# EAGLE schematic ROM (EAGLE 7.3.0)
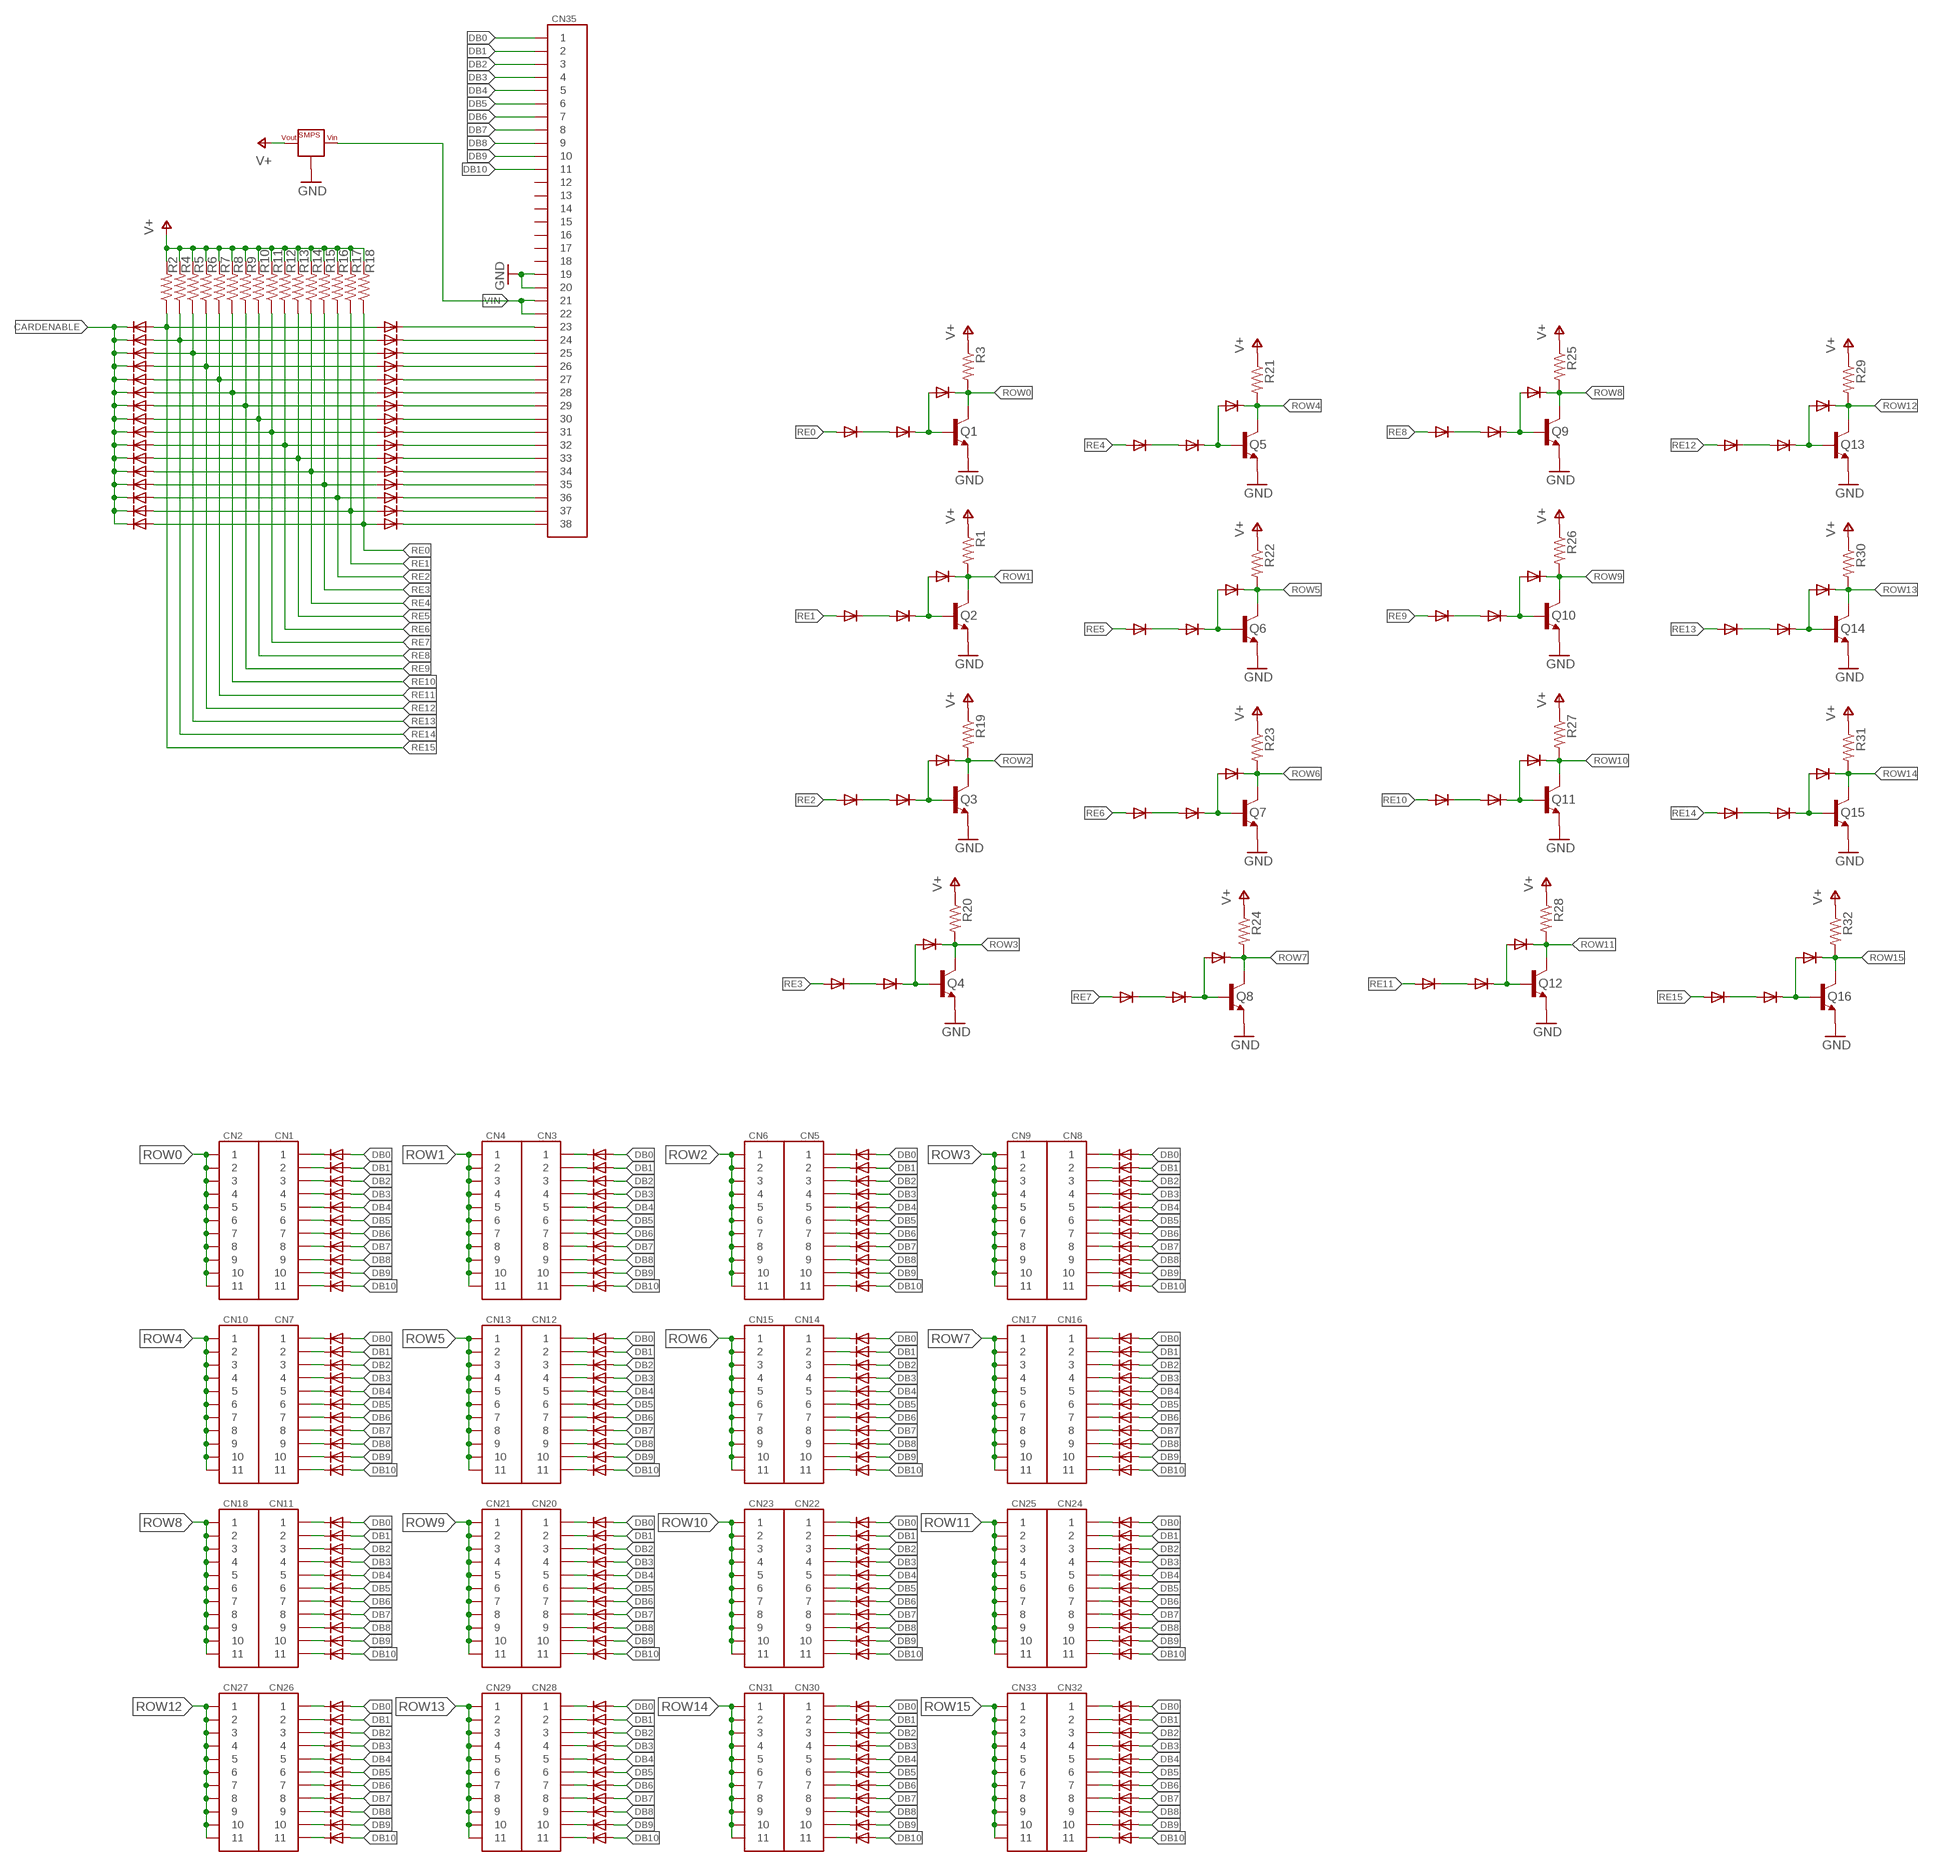
[diagram p0: schematic, sheet 1]

## Parts
CN1  HD11  [HD11]
CN2  HD11  [HD11]
CN3  HD11  [HD11]
CN4  HD11  [HD11]
CN5  HD11  [HD11]
CN6  HD11  [HD11]
CN7  HD11  [HD11]
CN8  HD11  [HD11]
CN9  HD11  [HD11]
CN10  HD11  [HD11]
CN11  HD11  [HD11]
CN12  HD11  [HD11]
CN13  HD11  [HD11]
CN14  HD11  [HD11]
CN15  HD11  [HD11]
CN16  HD11  [HD11]
CN17  HD11  [HD11]
CN18  HD11  [HD11]
CN20  HD11  [HD11]
CN21  HD11  [HD11]
CN22  HD11  [HD11]
CN23  HD11  [HD11]
CN24  HD11  [HD11]
CN25  HD11  [HD11]
CN26  HD11  [HD11]
CN27  HD11  [HD11]
CN28  HD11  [HD11]
CN29  HD11  [HD11]
CN30  HD11  [HD11]
CN31  HD11  [HD11]
CN32  HD11  [HD11]
CN33  HD11  [HD11]
CN35  HD38-HP  [HD38-HOLEPAD]
D1  DIODE-6.3  [DO35-6.3]
D2  DIODE-6.3  [DO35-6.3]
D3  DIODE-6.3  [DO35-6.3]
D4  DIODE-6.3  [DO35-6.3]
D5  DIODE-6.3  [DO35-6.3]
D6  DIODE-6.3  [DO35-6.3]
D7  DIODE-6.3  [DO35-6.3]
D8  DIODE-6.3  [DO35-6.3]
D9  DIODE-6.3  [DO35-6.3]
D10  DIODE-6.3  [DO35-6.3]
D11  DIODE-6.3  [DO35-6.3]
D12  DIODE-6.3  [DO35-6.3]
D13  DIODE-6.3  [DO35-6.3]
D14  DIODE-6.3  [DO35-6.3]
D15  DIODE-6.3  [DO35-6.3]
D16  DIODE-6.3  [DO35-6.3]
D17  DIODE-6.3  [DO35-6.3]
D18  DIODE-6.3  [DO35-6.3]
D19  DIODE-6.3  [DO35-6.3]
D20  DIODE-6.3  [DO35-6.3]
D21  DIODE-6.3  [DO35-6.3]
D22  DIODE-6.3  [DO35-6.3]
D23  DIODE-6.3  [DO35-6.3]
D24  DIODE-6.3  [DO35-6.3]
D25  DIODE-6.3  [DO35-6.3]
D26  DIODE-6.3  [DO35-6.3]
D27  DIODE-6.3  [DO35-6.3]
D28  DIODE-6.3  [DO35-6.3]
D29  DIODE-6.3  [DO35-6.3]
D30  DIODE-6.3  [DO35-6.3]
D31  DIODE-6.3  [DO35-6.3]
D32  DIODE-6.3  [DO35-6.3]
D33  DIODE-6.3  [DO35-6.3]
D34  DIODE-6.3  [DO35-6.3]
D35  DIODE-6.3  [DO35-6.3]
D36  DIODE-6.3  [DO35-6.3]
D37  DIODE-6.3  [DO35-6.3]
D38  DIODE-6.3  [DO35-6.3]
D39  DIODE-6.3  [DO35-6.3]
D40  DIODE-6.3  [DO35-6.3]
D41  DIODE-6.3  [DO35-6.3]
D42  DIODE-6.3  [DO35-6.3]
D43  DIODE-6.3  [DO35-6.3]
D44  DIODE-6.3  [DO35-6.3]
D45  DIODE-6.3  [DO35-6.3]
D46  DIODE-6.3  [DO35-6.3]
D47  DIODE-6.3  [DO35-6.3]
D48  DIODE-6.3  [DO35-6.3]
D49  DIODE-6.3  [DO35-6.3]
D50  DIODE-6.3  [DO35-6.3]
D51  DIODE-6.3  [DO35-6.3]
D52  DIODE-6.3  [DO35-6.3]
D53  DIODE-6.3  [DO35-6.3]
D54  DIODE-6.3  [DO35-6.3]
D55  DIODE-6.3  [DO35-6.3]
D56  DIODE-6.3  [DO35-6.3]
D57  DIODE-6.3  [DO35-6.3]
D58  DIODE-6.3  [DO35-6.3]
D59  DIODE-6.3  [DO35-6.3]
D60  DIODE-6.3  [DO35-6.3]
D61  DIODE-6.3  [DO35-6.3]
D62  DIODE-6.3  [DO35-6.3]
D63  DIODE-6.3  [DO35-6.3]
D64  DIODE-6.3  [DO35-6.3]
D65  DIODE-6.3  [DO35-6.3]
D66  DIODE-6.3  [DO35-6.3]
D67  DIODE-6.3  [DO35-6.3]
D68  DIODE-6.3  [DO35-6.3]
D69  DIODE-6.3  [DO35-6.3]
D70  DIODE-6.3  [DO35-6.3]
D71  DIODE-6.3  [DO35-6.3]
D72  DIODE-6.3  [DO35-6.3]
D73  DIODE-6.3  [DO35-6.3]
D74  DIODE-6.3  [DO35-6.3]
D75  DIODE-6.3  [DO35-6.3]
D76  DIODE-6.3  [DO35-6.3]
D77  DIODE-6.3  [DO35-6.3]
D78  DIODE-6.3  [DO35-6.3]
D79  DIODE-6.3  [DO35-6.3]
D80  DIODE-6.3  [DO35-6.3]
D81  DIODE-6.3  [DO35-6.3]
D82  DIODE-6.3  [DO35-6.3]
D83  DIODE-6.3  [DO35-6.3]
D84  DIODE-6.3  [DO35-6.3]
D85  DIODE-6.3  [DO35-6.3]
D86  DIODE-6.3  [DO35-6.3]
D87  DIODE-6.3  [DO35-6.3]
D88  DIODE-6.3  [DO35-6.3]
D89  DIODE-6.3  [DO35-6.3]
D90  DIODE-6.3  [DO35-6.3]
D91  DIODE-6.3  [DO35-6.3]
D92  DIODE-6.3  [DO35-6.3]
D93  DIODE-6.3  [DO35-6.3]
D94  DIODE-6.3  [DO35-6.3]
D95  DIODE-6.3  [DO35-6.3]
D96  DIODE-6.3  [DO35-6.3]
D97  DIODE-6.3  [DO35-6.3]
D98  DIODE-6.3  [DO35-6.3]
D99  DIODE-6.3  [DO35-6.3]
D100  DIODE-6.3  [DO35-6.3]
D101  DIODE-6.3  [DO35-6.3]
D102  DIODE-6.3  [DO35-6.3]
D103  DIODE-6.3  [DO35-6.3]
D104  DIODE-6.3  [DO35-6.3]
D105  DIODE-6.3  [DO35-6.3]
D106  DIODE-6.3  [DO35-6.3]
D107  DIODE-6.3  [DO35-6.3]
D108  DIODE-6.3  [DO35-6.3]
D109  DIODE-6.3  [DO35-6.3]
D110  DIODE-6.3  [DO35-6.3]
D111  DIODE-6.3  [DO35-6.3]
D112  DIODE-6.3  [DO35-6.3]
D113  DIODE-6.3  [DO35-6.3]
D114  DIODE-6.3  [DO35-6.3]
D115  DIODE-6.3  [DO35-6.3]
D116  DIODE-6.3  [DO35-6.3]
D117  DIODE-6.3  [DO35-6.3]
D118  DIODE-6.3  [DO35-6.3]
D119  DIODE-6.3  [DO35-6.3]
D120  DIODE-6.3  [DO35-6.3]
D121  DIODE-6.3  [DO35-6.3]
D122  DIODE-6.3  [DO35-6.3]
D123  DIODE-6.3  [DO35-6.3]
D124  DIODE-6.3  [DO35-6.3]
D125  DIODE-6.3  [DO35-6.3]
D126  DIODE-6.3  [DO35-6.3]
D127  DIODE-6.3  [DO35-6.3]
D128  DIODE-6.3  [DO35-6.3]
D129  DIODE-6.3  [DO35-6.3]
D130  DIODE-6.3  [DO35-6.3]
D131  DIODE-6.3  [DO35-6.3]
D132  DIODE-6.3  [DO35-6.3]
D133  DIODE-6.3  [DO35-6.3]
D134  DIODE-6.3  [DO35-6.3]
D135  DIODE-6.3  [DO35-6.3]
D136  DIODE-6.3  [DO35-6.3]
D137  DIODE-6.3  [DO35-6.3]
D138  DIODE-6.3  [DO35-6.3]
D139  DIODE-6.3  [DO35-6.3]
D140  DIODE-6.3  [DO35-6.3]
D141  DIODE-6.3  [DO35-6.3]
D142  DIODE-6.3  [DO35-6.3]
D143  DIODE-6.3  [DO35-6.3]
D144  DIODE-6.3  [DO35-6.3]
D145  DIODE-6.3  [DO35-6.3]
D146  DIODE-6.3  [DO35-6.3]
D147  DIODE-6.3  [DO35-6.3]
D148  DIODE-6.3  [DO35-6.3]
D149  DIODE-6.3  [DO35-6.3]
D150  DIODE-6.3  [DO35-6.3]
D151  DIODE-6.3  [DO35-6.3]
D152  DIODE-6.3  [DO35-6.3]
D153  DIODE-6.3  [DO35-6.3]
D154  DIODE-6.3  [DO35-6.3]
D155  DIODE-6.3  [DO35-6.3]
D156  DIODE-6.3  [DO35-6.3]
D157  DIODE-6.3  [DO35-6.3]
D158  DIODE-6.3  [DO35-6.3]
D159  DIODE-6.3  [DO35-6.3]
D160  DIODE-6.3  [DO35-6.3]
D161  DIODE-6.3  [DO35-6.3]
D162  DIODE-6.3  [DO35-6.3]
D163  DIODE-6.3  [DO35-6.3]
D164  DIODE-6.3  [DO35-6.3]
D165  DIODE-6.3  [DO35-6.3]
D166  DIODE-6.3  [DO35-6.3]
D167  DIODE-6.3  [DO35-6.3]
D168  DIODE-6.3  [DO35-6.3]
D169  DIODE-6.3  [DO35-6.3]
D170  DIODE-6.3  [DO35-6.3]
D171  DIODE-6.3  [DO35-6.3]
D172  DIODE-6.3  [DO35-6.3]
D173  DIODE-6.3  [DO35-6.3]
D174  DIODE-6.3  [DO35-6.3]
D175  DIODE-6.3  [DO35-6.3]
D176  DIODE-6.3  [DO35-6.3]
D177  DIODE-5.08  [DO35-5.08]
D178  DIODE-5.08  [DO35-5.08]
D179  DIODE-5.08  [DO35-5.08]
D180  DIODE-5.08  [DO35-5.08]
D181  DIODE-5.08  [DO35-5.08]
D182  DIODE-5.08  [DO35-5.08]
D183  DIODE-5.08  [DO35-5.08]
D184  DIODE-5.08  [DO35-5.08]
D185  DIODE-5.08  [DO35-5.08]
D186  DIODE-5.08  [DO35-5.08]
D187  DIODE-5.08  [DO35-5.08]
D188  DIODE-5.08  [DO35-5.08]
D189  DIODE-5.08  [DO35-5.08]
D190  DIODE-5.08  [DO35-5.08]
D191  DIODE-5.08  [DO35-5.08]
D192  DIODE-5.08  [DO35-5.08]
D193  DIODE-5.08  [DO35-5.08]
D194  DIODE-5.08  [DO35-5.08]
D195  DIODE-5.08  [DO35-5.08]
D196  DIODE-5.08  [DO35-5.08]
D197  DIODE-5.08  [DO35-5.08]
D198  DIODE-5.08  [DO35-5.08]
D199  DIODE-5.08  [DO35-5.08]
D200  DIODE-5.08  [DO35-5.08]
D201  DIODE-5.08  [DO35-5.08]
D202  DIODE-5.08  [DO35-5.08]
D203  DIODE-5.08  [DO35-5.08]
D204  DIODE-5.08  [DO35-5.08]
D205  DIODE-5.08  [DO35-5.08]
D206  DIODE-5.08  [DO35-5.08]
D207  DIODE-5.08  [DO35-5.08]
D208  DIODE-5.08  [DO35-5.08]
D209  DIODE-5.08  [DO35-5.08]
D210  DIODE-5.08  [DO35-5.08]
D211  DIODE-5.08  [DO35-5.08]
D212  DIODE-5.08  [DO35-5.08]
D213  DIODE-5.08  [DO35-5.08]
D214  DIODE-5.08  [DO35-5.08]
D215  DIODE-5.08  [DO35-5.08]
D216  DIODE-5.08  [DO35-5.08]
D217  DIODE-5.08  [DO35-5.08]
D218  DIODE-5.08  [DO35-5.08]
D219  DIODE-5.08  [DO35-5.08]
D220  DIODE-5.08  [DO35-5.08]
D221  DIODE-5.08  [DO35-5.08]
D222  DIODE-5.08  [DO35-5.08]
D223  DIODE-5.08  [DO35-5.08]
D224  DIODE-5.08  [DO35-5.08]
D225  DIODE-5.08  [DO35-5.08]
D226  DIODE-5.08  [DO35-5.08]
D227  DIODE-5.08  [DO35-5.08]
D228  DIODE-5.08  [DO35-5.08]
D229  DIODE-5.08  [DO35-5.08]
D230  DIODE-5.08  [DO35-5.08]
D231  DIODE-5.08  [DO35-5.08]
D232  DIODE-5.08  [DO35-5.08]
D233  DIODE-5.08  [DO35-5.08]
D234  DIODE-5.08  [DO35-5.08]
D235  DIODE-5.08  [DO35-5.08]
D236  DIODE-5.08  [DO35-5.08]
D237  DIODE-5.08  [DO35-5.08]
D238  DIODE-5.08  [DO35-5.08]
D239  DIODE-5.08  [DO35-5.08]
D240  DIODE-5.08  [DO35-5.08]
D241  DIODE-5.08  [DO35-5.08]
D242  DIODE-5.08  [DO35-5.08]
D243  DIODE-5.08  [DO35-5.08]
D244  DIODE-5.08  [DO35-5.08]
D245  DIODE-5.08  [DO35-5.08]
D246  DIODE-5.08  [DO35-5.08]
D247  DIODE-5.08  [DO35-5.08]
D248  DIODE-5.08  [DO35-5.08]
D249  DIODE-5.08  [DO35-5.08]
D250  DIODE-5.08  [DO35-5.08]
D251  DIODE-5.08  [DO35-5.08]
D252  DIODE-5.08  [DO35-5.08]
D253  DIODE-5.08  [DO35-5.08]
D254  DIODE-5.08  [DO35-5.08]
D255  DIODE-5.08  [DO35-5.08]
D256  DIODE-5.08  [DO35-5.08]
Q1  BC547-STRAIGHT  [TO92-S-CBE]
Q2  BC547-STRAIGHT  [TO92-S-CBE]
Q3  BC547-STRAIGHT  [TO92-S-CBE]
Q4  BC547-STRAIGHT  [TO92-S-CBE]
Q5  BC547-STRAIGHT  [TO92-S-CBE]
Q6  BC547-STRAIGHT  [TO92-S-CBE]
Q7  BC547-STRAIGHT  [TO92-S-CBE]
Q8  BC547-STRAIGHT  [TO92-S-CBE]
Q9  BC547-STRAIGHT  [TO92-S-CBE]
Q10  BC547-STRAIGHT  [TO92-S-CBE]
Q11  BC547-STRAIGHT  [TO92-S-CBE]
Q12  BC547-STRAIGHT  [TO92-S-CBE]
Q13  BC547-STRAIGHT  [TO92-S-CBE]
Q14  BC547-STRAIGHT  [TO92-S-CBE]
Q15  BC547-STRAIGHT  [TO92-S-CBE]
Q16  BC547-STRAIGHT  [TO92-S-CBE]
R1  R1/8-6MM  [R0125-6.3]
R2  R1/8-6MM  [R0125-6.3]
R3  R1/8-6MM  [R0125-6.3]
R4  R1/8-6MM  [R0125-6.3]
R5  R1/8-6MM  [R0125-6.3]
R6  R1/8-6MM  [R0125-6.3]
R7  R1/8-6MM  [R0125-6.3]
R8  R1/8-6MM  [R0125-6.3]
R9  R1/8-6MM  [R0125-6.3]
R10  R1/8-6MM  [R0125-6.3]
R11  R1/8-6MM  [R0125-6.3]
R12  R1/8-6MM  [R0125-6.3]
R13  R1/8-6MM  [R0125-6.3]
R14  R1/8-6MM  [R0125-6.3]
R15  R1/8-6MM  [R0125-6.3]
R16  R1/8-6MM  [R0125-6.3]
R17  R1/8-6MM  [R0125-6.3]
R18  R1/8-6MM  [R0125-6.3]
R19  R1/8-6MM  [R0125-6.3]
R20  R1/8-6MM  [R0125-6.3]
R21  R1/8-6MM  [R0125-6.3]
R22  R1/8-6MM  [R0125-6.3]
R23  R1/8-6MM  [R0125-6.3]
R24  R1/8-6MM  [R0125-6.3]
R25  R1/8-6MM  [R0125-6.3]
R26  R1/8-6MM  [R0125-6.3]
R27  R1/8-6MM  [R0125-6.3]
R28  R1/8-6MM  [R0125-6.3]
R29  R1/8-6MM  [R0125-6.3]
R30  R1/8-6MM  [R0125-6.3]
R31  R1/8-6MM  [R0125-6.3]
R32  R1/8-6MM  [R0125-6.3]
VR1  SMPS  [BUCK1722]

## Nets
CARDENABLE: D182.C D183.C D184.C D185.C D186.C D187.C D188.C D189.C D190.C D191.C D192.C D193.C D194.C D195.C D196.C D197.C
DB0: CN35.P1@1 CN35.P1@2 D1.A D12.A D23.A D34.A D45.A D56.A D67.A D78.A D89.A D100.A D111.A D122.A D133.A D144.A D155.A D166.A
DB1: CN35.P2@1 CN35.P2@2 D2.A D13.A D24.A D35.A D46.A D57.A D68.A D79.A D90.A D101.A D112.A D123.A D134.A D145.A D156.A D167.A
DB2: CN35.P3@1 CN35.P3@2 D3.A D14.A D25.A D36.A D47.A D58.A D69.A D80.A D91.A D102.A D113.A D124.A D135.A D146.A D157.A D168.A
DB3: CN35.P4@1 CN35.P4@2 D4.A D15.A D26.A D37.A D48.A D59.A D70.A D81.A D92.A D103.A D114.A D125.A D136.A D147.A D158.A D169.A
DB4: CN35.P5@1 CN35.P5@2 D5.A D16.A D27.A D38.A D49.A D60.A D71.A D82.A D93.A D104.A D115.A D126.A D137.A D148.A D159.A D170.A
DB5: CN35.P6@1 CN35.P6@2 D6.A D17.A D28.A D39.A D50.A D61.A D72.A D83.A D94.A D105.A D116.A D127.A D138.A D149.A D160.A D171.A
DB6: CN35.P7@1 CN35.P7@2 D7.A D18.A D29.A D40.A D51.A D62.A D73.A D84.A D95.A D106.A D117.A D128.A D139.A D150.A D161.A D172.A
DB7: CN35.P8@1 CN35.P8@2 D8.A D19.A D30.A D41.A D52.A D63.A D74.A D85.A D96.A D107.A D118.A D129.A D140.A D151.A D162.A D173.A
DB8: CN35.P9@1 CN35.P9@2 D9.A D20.A D31.A D42.A D53.A D64.A D75.A D86.A D97.A D108.A D119.A D130.A D141.A D152.A D163.A D174.A
DB9: CN35.P10@1 CN35.P10@2 D10.A D21.A D32.A D43.A D54.A D65.A D76.A D87.A D98.A D109.A D120.A D131.A D142.A D153.A D164.A D175.A
DB10: CN35.P11@1 CN35.P11@2 D11.A D22.A D33.A D44.A D55.A D66.A D77.A D88.A D99.A D110.A D121.A D132.A D143.A D154.A D165.A D176.A
GND: CN35.P19@1 CN35.P19@2 CN35.P20@1 CN35.P20@2 Q1.E Q2.E Q3.E Q4.E Q5.E Q6.E Q7.E Q8.E Q9.E Q10.E Q11.E Q12.E Q13.E Q14.E Q15.E Q16.E VR1.GND@1(GND) VR1.GND@2(GND) VR1.GND@3(GND) VR1.GND@4(GND)
N$1: CN1.P$1 D1.C
N$2: CN1.P$2 D2.C
N$3: CN1.P$3 D3.C
N$4: CN1.P$4 D4.C
N$5: CN1.P$5 D5.C
N$6: CN1.P$6 D6.C
N$7: CN1.P$7 D7.C
N$8: CN1.P$8 D8.C
N$9: CN1.P$9 D9.C
N$10: CN1.P$10 D10.C
N$11: CN1.P$11 D11.C
N$12: CN3.P$1 D12.C
N$13: CN3.P$2 D13.C
N$14: CN3.P$3 D14.C
N$15: CN3.P$4 D15.C
N$16: CN3.P$5 D16.C
N$17: CN3.P$6 D17.C
N$18: CN3.P$7 D18.C
N$19: CN3.P$8 D19.C
N$20: CN3.P$9 D20.C
N$21: CN3.P$10 D21.C
N$22: CN3.P$11 D22.C
N$23: CN5.P$1 D23.C
N$24: CN5.P$2 D24.C
N$25: CN5.P$3 D25.C
N$26: CN5.P$4 D26.C
N$27: CN5.P$5 D27.C
N$28: CN5.P$6 D28.C
N$29: CN5.P$7 D29.C
N$30: CN5.P$8 D30.C
N$31: CN5.P$9 D31.C
N$32: CN5.P$10 D32.C
N$33: CN5.P$11 D33.C
N$34: CN8.P$1 D34.C
N$35: CN8.P$2 D35.C
N$36: CN8.P$3 D36.C
N$37: CN8.P$4 D37.C
N$38: CN8.P$5 D38.C
N$39: CN8.P$6 D39.C
N$40: CN8.P$7 D40.C
N$41: CN8.P$8 D41.C
N$42: CN8.P$9 D42.C
N$43: CN8.P$10 D43.C
N$44: CN8.P$11 D44.C
N$45: CN7.P$1 D45.C
N$46: CN7.P$2 D46.C
N$47: CN7.P$3 D47.C
N$48: CN7.P$4 D48.C
N$49: CN7.P$5 D49.C
N$50: CN7.P$6 D50.C
N$51: CN7.P$7 D51.C
N$52: CN7.P$8 D52.C
N$53: CN7.P$9 D53.C
N$54: CN7.P$10 D54.C
N$55: CN7.P$11 D55.C
N$56: CN12.P$1 D56.C
N$57: CN12.P$2 D57.C
N$58: CN12.P$3 D58.C
N$59: CN12.P$4 D59.C
N$60: CN12.P$5 D60.C
N$61: CN12.P$6 D61.C
N$62: CN12.P$7 D62.C
N$63: CN12.P$8 D63.C
N$64: CN12.P$9 D64.C
N$65: CN12.P$10 D65.C
N$66: CN12.P$11 D66.C
N$67: CN14.P$1 D67.C
N$68: CN14.P$2 D68.C
N$69: CN14.P$3 D69.C
N$70: CN14.P$4 D70.C
N$71: CN14.P$5 D71.C
N$72: CN14.P$6 D72.C
N$73: CN14.P$7 D73.C
N$74: CN14.P$8 D74.C
N$75: CN14.P$9 D75.C
N$76: CN14.P$10 D76.C
N$77: CN14.P$11 D77.C
N$78: CN16.P$1 D78.C
N$79: CN16.P$2 D79.C
N$80: CN16.P$3 D80.C
N$81: CN16.P$4 D81.C
N$82: CN16.P$5 D82.C
N$83: CN16.P$6 D83.C
N$84: CN16.P$7 D84.C
N$85: CN16.P$8 D85.C
N$86: CN16.P$9 D86.C
N$87: CN16.P$10 D87.C
N$88: CN16.P$11 D88.C
N$89: CN11.P$1 D89.C
N$90: CN11.P$2 D90.C
N$91: CN11.P$3 D91.C
N$92: CN11.P$4 D92.C
N$93: CN11.P$5 D93.C
N$94: CN11.P$6 D94.C
N$95: CN11.P$7 D95.C
N$96: CN11.P$8 D96.C
N$97: CN11.P$9 D97.C
N$98: CN11.P$10 D98.C
N$99: CN11.P$11 D99.C
N$100: CN20.P$1 D100.C
N$101: CN20.P$2 D101.C
N$102: CN20.P$3 D102.C
N$103: CN20.P$4 D103.C
N$104: CN20.P$5 D104.C
N$105: CN20.P$6 D105.C
N$106: CN20.P$7 D106.C
N$107: CN20.P$8 D107.C
N$108: CN20.P$9 D108.C
N$109: CN20.P$10 D109.C
N$110: CN20.P$11 D110.C
N$111: CN22.P$1 D111.C
N$112: CN22.P$2 D112.C
N$113: CN22.P$3 D113.C
N$114: CN22.P$4 D114.C
N$115: CN22.P$5 D115.C
N$116: CN22.P$6 D116.C
N$117: CN22.P$7 D117.C
N$118: CN22.P$8 D118.C
N$119: CN22.P$9 D119.C
N$120: CN22.P$10 D120.C
N$121: CN22.P$11 D121.C
N$122: CN24.P$1 D122.C
N$123: CN24.P$2 D123.C
N$124: CN24.P$3 D124.C
N$125: CN24.P$4 D125.C
N$126: CN24.P$5 D126.C
N$127: CN24.P$6 D127.C
N$128: CN24.P$7 D128.C
N$129: CN24.P$8 D129.C
N$130: CN24.P$9 D130.C
N$131: CN24.P$10 D131.C
N$132: CN24.P$11 D132.C
N$133: CN26.P$1 D133.C
N$134: CN26.P$2 D134.C
N$135: CN26.P$3 D135.C
N$136: CN26.P$4 D136.C
N$137: CN26.P$5 D137.C
N$138: CN26.P$6 D138.C
N$139: CN26.P$7 D139.C
N$140: CN26.P$8 D140.C
N$141: CN26.P$9 D141.C
N$142: CN26.P$10 D142.C
N$143: CN26.P$11 D143.C
N$144: CN28.P$1 D144.C
N$145: CN28.P$2 D145.C
N$146: CN28.P$3 D146.C
N$147: CN28.P$4 D147.C
N$148: CN28.P$5 D148.C
N$149: CN28.P$6 D149.C
N$150: CN28.P$7 D150.C
N$151: CN28.P$8 D151.C
N$152: CN28.P$9 D152.C
N$153: CN28.P$10 D153.C
N$154: CN28.P$11 D154.C
N$155: CN30.P$1 D155.C
N$156: CN30.P$2 D156.C
N$157: CN30.P$3 D157.C
N$158: CN30.P$4 D158.C
N$159: CN30.P$5 D159.C
N$160: CN30.P$6 D160.C
N$161: CN30.P$7 D161.C
N$162: CN30.P$8 D162.C
N$163: CN30.P$9 D163.C
N$164: CN30.P$10 D164.C
N$165: CN30.P$11 D165.C
N$166: CN32.P$1 D166.C
N$167: CN32.P$2 D167.C
N$168: CN32.P$3 D168.C
N$169: CN32.P$4 D169.C
N$170: CN32.P$5 D170.C
N$171: CN32.P$6 D171.C
N$172: CN32.P$7 D172.C
N$173: CN32.P$8 D173.C
N$174: CN32.P$9 D174.C
N$175: CN32.P$10 D175.C
N$176: CN32.P$11 D176.C
N$177: D215.A D216.C
N$178: D177.C D181.A Q1.B
N$179: D177.A D178.C
N$180: D212.C D214.A Q2.B
N$181: D212.A D213.C
N$182: D215.C D217.A Q3.B
N$183: D242.A D243.C
N$184: D218.C D220.A Q4.B
N$185: D218.A D219.C
N$186: D221.C D223.A Q5.B
N$187: D221.A D222.C
N$188: D224.C D226.A Q6.B
N$189: D224.A D225.C
N$190: D227.C D229.A Q7.B
N$191: D227.A D228.C
N$192: D230.C D232.A Q8.B
N$193: D230.A D231.C
N$194: D233.C D235.A Q9.B
N$195: D233.A D234.C
N$196: D236.C D238.A Q10.B
N$198: D239.C D241.A Q11.B
N$199: D239.A D240.C
N$200: D242.C D244.A Q12.B
N$201: D251.A D252.C
N$202: D245.C D247.A Q13.B
N$203: D236.A D237.C
N$204: D248.C D250.A Q14.B
N$205: D245.A D246.C
N$206: D251.C D253.A Q15.B
N$207: D248.A D249.C
N$208: D254.C D256.A Q16.B
N$209: D254.A D255.C
RE0: D178.A D197.A D211.A R18.1
RE1: D196.A D210.A D213.A R17.1
RE2: D195.A D209.A D216.A R16.1
RE3: D194.A D208.A D219.A R15.1
RE4: D193.A D207.A D222.A R14.1
RE5: D192.A D206.A D225.A R13.1
RE6: D191.A D205.A D228.A R12.1
RE7: D190.A D204.A D231.A R11.1
RE8: D189.A D203.A D234.A R10.1
RE9: D188.A D202.A D237.A R9.1
RE10: D187.A D201.A D240.A R8.1
RE11: D186.A D200.A D243.A R7.1
RE12: D185.A D199.A D246.A R6.1
RE13: D184.A D198.A D249.A R5.1
RE14: D180.A D183.A D252.A R4.1
RE15: D179.A D182.A D255.A R2.1
ROW0: CN2.P$1 CN2.P$2 CN2.P$3 CN2.P$4 CN2.P$5 CN2.P$6 CN2.P$7 CN2.P$8 CN2.P$9 CN2.P$10 CN2.P$11 D181.C Q1.C R3.2
ROW1: CN4.P$1 CN4.P$2 CN4.P$3 CN4.P$4 CN4.P$5 CN4.P$6 CN4.P$7 CN4.P$8 CN4.P$9 CN4.P$10 CN4.P$11 D214.C Q2.C R1.2
ROW2: CN6.P$1 CN6.P$2 CN6.P$3 CN6.P$4 CN6.P$5 CN6.P$6 CN6.P$7 CN6.P$8 CN6.P$9 CN6.P$10 CN6.P$11 D217.C Q3.C R19.2
ROW3: CN9.P$1 CN9.P$2 CN9.P$3 CN9.P$4 CN9.P$5 CN9.P$6 CN9.P$7 CN9.P$8 CN9.P$9 CN9.P$10 CN9.P$11 D220.C Q4.C R20.2
ROW4: CN10.P$1 CN10.P$2 CN10.P$3 CN10.P$4 CN10.P$5 CN10.P$6 CN10.P$7 CN10.P$8 CN10.P$9 CN10.P$10 CN10.P$11 D223.C Q5.C R21.2
ROW5: CN13.P$1 CN13.P$2 CN13.P$3 CN13.P$4 CN13.P$5 CN13.P$6 CN13.P$7 CN13.P$8 CN13.P$9 CN13.P$10 CN13.P$11 D226.C Q6.C R22.2
ROW6: CN15.P$1 CN15.P$2 CN15.P$3 CN15.P$4 CN15.P$5 CN15.P$6 CN15.P$7 CN15.P$8 CN15.P$9 CN15.P$10 CN15.P$11 D229.C Q7.C R23.2
ROW7: CN17.P$1 CN17.P$2 CN17.P$3 CN17.P$4 CN17.P$5 CN17.P$6 CN17.P$7 CN17.P$8 CN17.P$9 CN17.P$10 CN17.P$11 D232.C Q8.C R24.2
ROW8: CN18.P$1 CN18.P$2 CN18.P$3 CN18.P$4 CN18.P$5 CN18.P$6 CN18.P$7 CN18.P$8 CN18.P$9 CN18.P$10 CN18.P$11 D235.C Q9.C R25.2
ROW9: CN21.P$1 CN21.P$2 CN21.P$3 CN21.P$4 CN21.P$5 CN21.P$6 CN21.P$7 CN21.P$8 CN21.P$9 CN21.P$10 CN21.P$11 D238.C Q10.C R26.2
ROW10: CN23.P$1 CN23.P$2 CN23.P$3 CN23.P$4 CN23.P$5 CN23.P$6 CN23.P$7 CN23.P$8 CN23.P$9 CN23.P$10 CN23.P$11 D241.C Q11.C R27.2
ROW11: CN25.P$1 CN25.P$2 CN25.P$3 CN25.P$4 CN25.P$5 CN25.P$6 CN25.P$7 CN25.P$8 CN25.P$9 CN25.P$10 CN25.P$11 D244.C Q12.C R28.2
ROW12: CN27.P$1 CN27.P$2 CN27.P$3 CN27.P$4 CN27.P$5 CN27.P$6 CN27.P$7 CN27.P$8 CN27.P$9 CN27.P$10 CN27.P$11 D247.C Q13.C R29.2
ROW13: CN29.P$1 CN29.P$2 CN29.P$3 CN29.P$4 CN29.P$5 CN29.P$6 CN29.P$7 CN29.P$8 CN29.P$9 CN29.P$10 CN29.P$11 D250.C Q14.C R30.2
ROW14: CN31.P$1 CN31.P$2 CN31.P$3 CN31.P$4 CN31.P$5 CN31.P$6 CN31.P$7 CN31.P$8 CN31.P$9 CN31.P$10 CN31.P$11 D253.C Q15.C R31.2
ROW15: CN33.P$1 CN33.P$2 CN33.P$3 CN33.P$4 CN33.P$5 CN33.P$6 CN33.P$7 CN33.P$8 CN33.P$9 CN33.P$10 CN33.P$11 D256.C Q16.C R32.2
SEL0: CN35.P23@1 CN35.P23@2 D179.C
SEL1: CN35.P24@1 CN35.P24@2 D180.C
SEL2: CN35.P25@1 CN35.P25@2 D198.C
SEL3: CN35.P26@1 CN35.P26@2 D199.C
SEL4: CN35.P27@1 CN35.P27@2 D200.C
SEL5: CN35.P28@1 CN35.P28@2 D201.C
SEL6: CN35.P29@1 CN35.P29@2 D202.C
SEL7: CN35.P30@1 CN35.P30@2 D203.C
SEL8: CN35.P31@1 CN35.P31@2 D204.C
SEL9: CN35.P32@1 CN35.P32@2 D205.C
SEL10: CN35.P33@1 CN35.P33@2 D206.C
SEL11: CN35.P34@1 CN35.P34@2 D207.C
SEL12: CN35.P35@1 CN35.P35@2 D208.C
SEL13: CN35.P36@1 CN35.P36@2 D209.C
SEL14: CN35.P37@1 CN35.P37@2 D210.C
SEL15: CN35.P38@1 CN35.P38@2 D211.C
V+: R1.1 R2.2 R3.1 R4.2 R5.2 R6.2 R7.2 R8.2 R9.2 R10.2 R11.2 R12.2 R13.2 R14.2 R15.2 R16.2 R17.2 R18.2 R19.1 R20.1 R21.1 R22.1 R23.1 R24.1 R25.1 R26.1 R27.1 R28.1 R29.1 R30.1 R31.1 R32.1 VR1.OUT@1(VOUT) VR1.OUT@2(VOUT)
VIN: CN35.P21@1 CN35.P21@2 CN35.P22@1 CN35.P22@2 VR1.IN@1(VIN) VR1.IN@2(VIN)
Unconnected: CN35.P12@1 CN35.P12@2 CN35.P13@1 CN35.P13@2 CN35.P14@1 CN35.P14@2 CN35.P15@1 CN35.P15@2 CN35.P16@1 CN35.P16@2 CN35.P17@1 CN35.P17@2 CN35.P18@1 CN35.P18@2

## Library data of the parts
CN1-CN18 CN20-CN33 = SmallRoomLabs_ConSwitch:HD11
CN35 = SmallRoomLabs_ConSwitch:HD38
D1-D256 = SmallRoomLabs_Semiconductor:DIODE
Q1-Q16 = SmallRoomLabs_Semiconductor:BC547
R1-R32 = SmallRoomLabs_Discrete:R
VR1 = SmallRoomLabs_Battery:SMPS